# Altium schematic sheet supply.SchDoc: DevelBoard EVA01 Power Supply.
size A3; Author: Daniele Basile <asterix@develer.com>; Organization: Develer s.r.l.; Address1: via Mugellese 1/A; Address2: 50019 Campi Bisenzio; Address3: Firenze; Address4: ITALY; DocumentNumber: 2; Revision: A; SheetNumber: 4; SheetTotal: 6
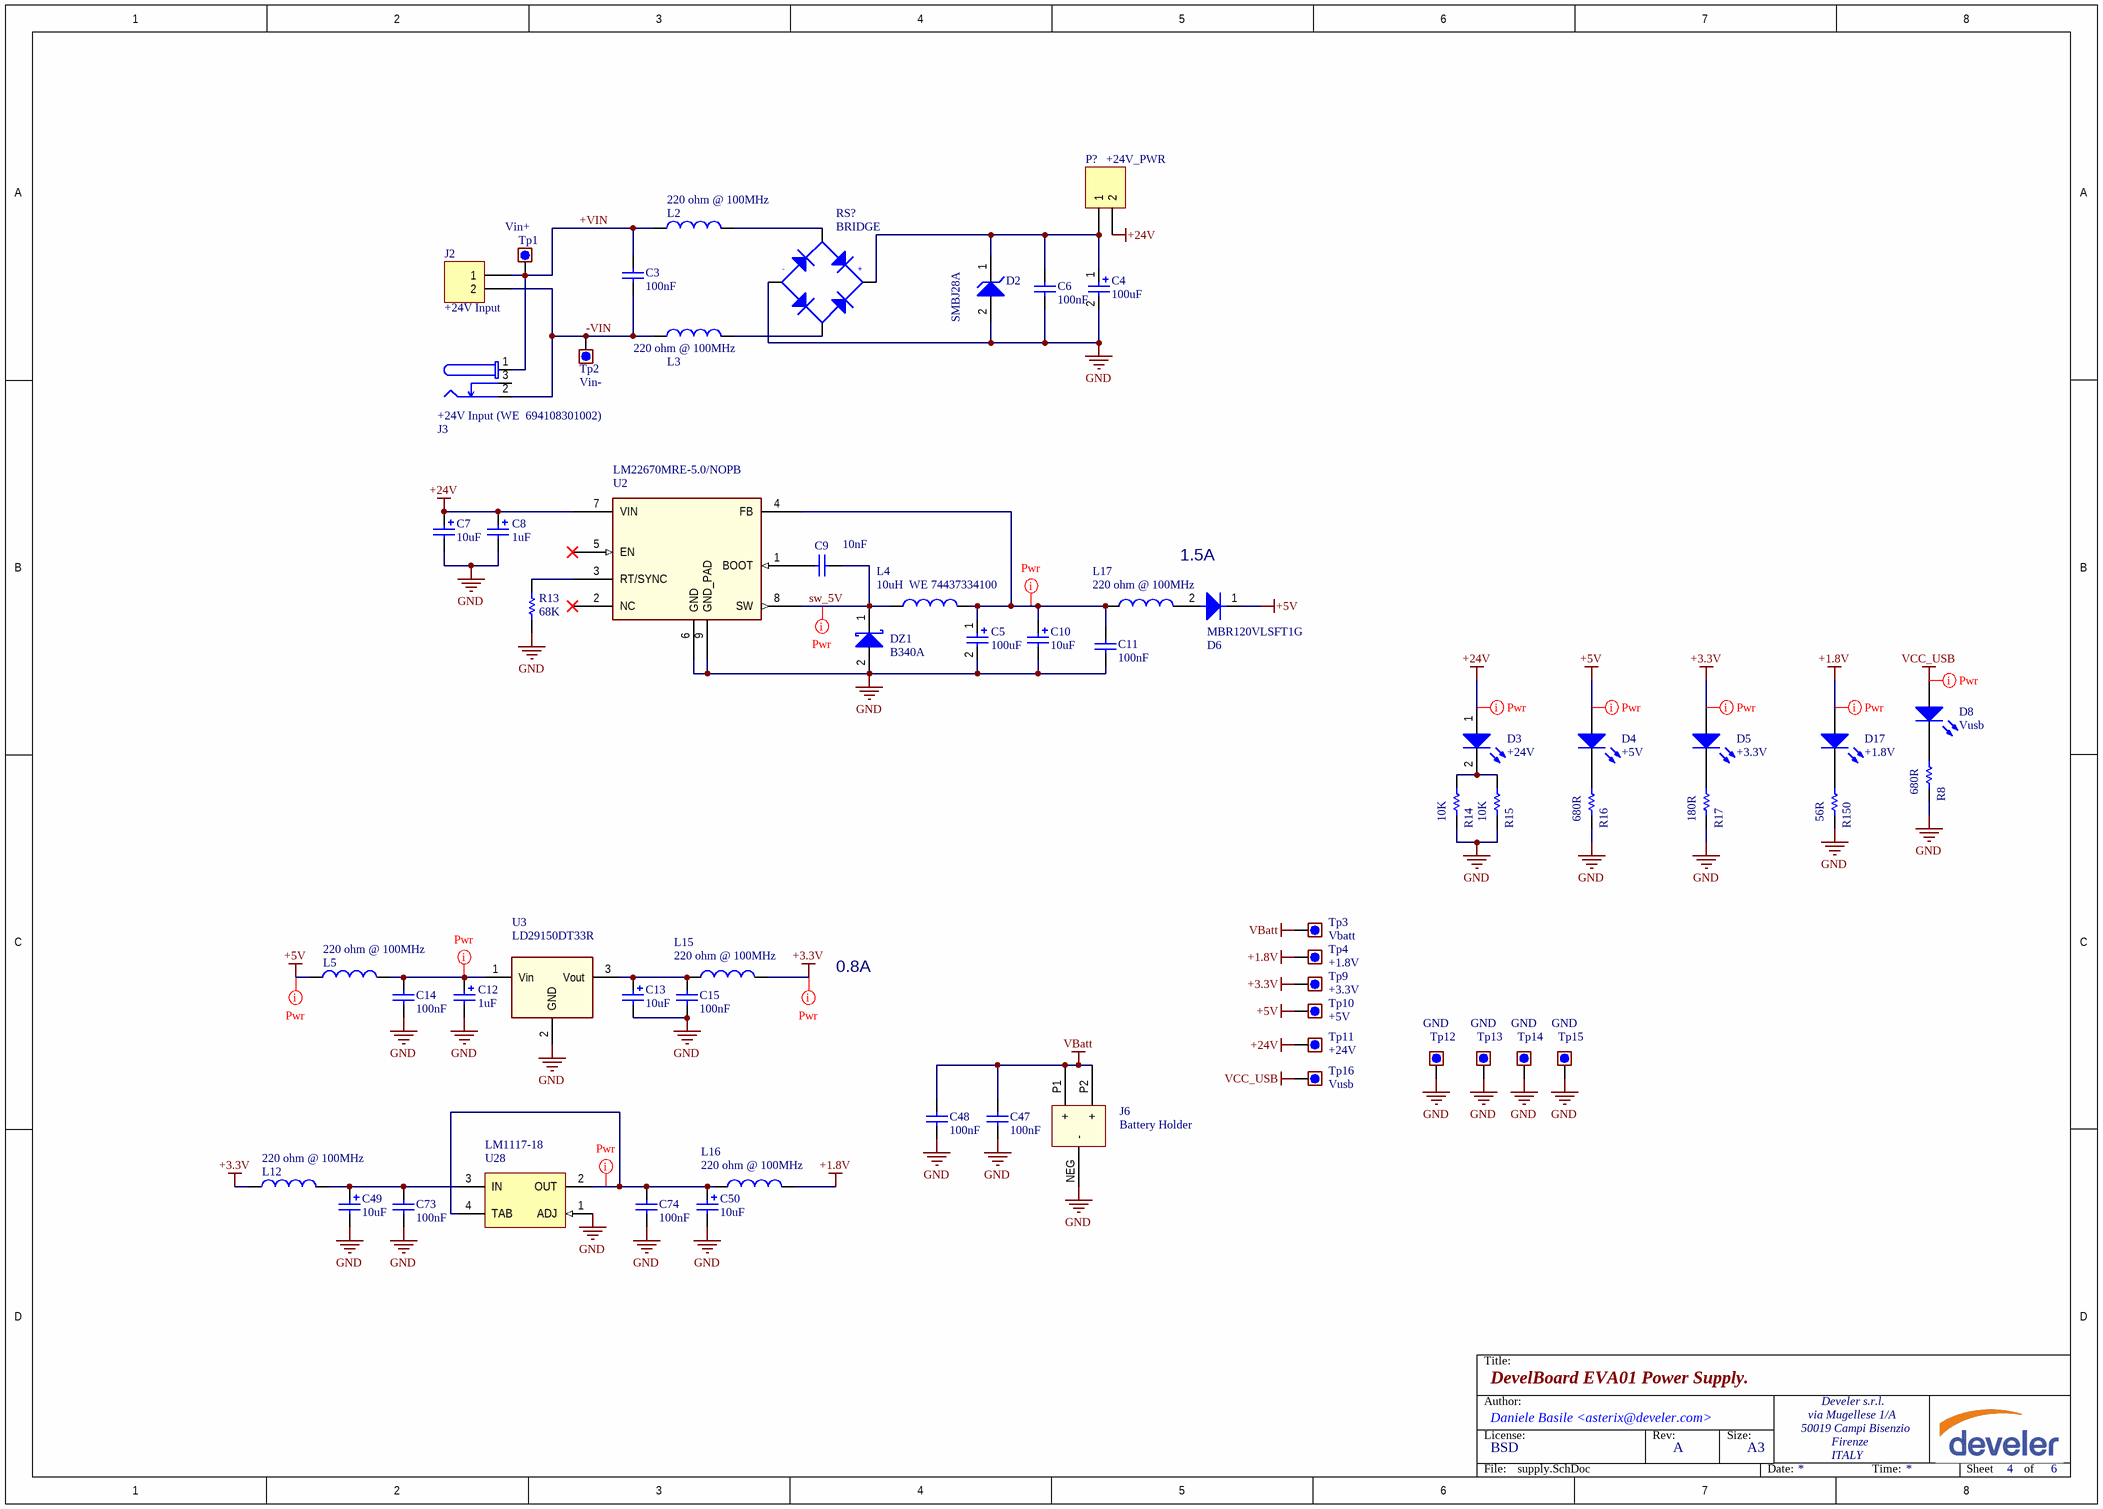
[diagram p0: supply.SchDoc]

## Parts
C3  100nF  [0603_[1608]]
C4  100uF  [CAP_6x6_D8_SMD]
C5  100uF  [[7343]_CAP_TAN]
C6  100nF  [0603_[1608]]
C7  10uF  [1206_[3216]]
C8  1uF  [1206_[3216]]
C9  10nF  [0603_[1608]]
C10  10uF  [1206_[3216]]
C11  100nF  [0603_[1608]]
C12  1uF  [1206_[3216]]
C13  10uF  [1206_[3216]]
C14  100nF  [0603_[1608]]
C15  100nF  [0603_[1608]]
C47  100nF  [0603_[1608]]
C48  100nF  [0603_[1608]]
C49  10uF  [1206_[3216]]
C50  10uF  [1206_[3216]]
C73  100nF  [0603_[1608]]
C74  100nF  [0603_[1608]]
D2  SMBJ28A  [DO214AA_12]
D3  +24V  [0603_[1608]_LED]
D4  +5V  [0603_[1608]_LED]
D5  +3.3V  [0603_[1608]_LED]
D6  MBR120VLSFT1G  [SOD-123]
D8  Vusb  [0603_[1608]_LED]
D17  +1.8V  [0603_[1608]_LED]
DZ1  B340A  [DO214AA_12]
J2  +24V Input  [TBLOCK_1X2_3.5MM_HOR_THD]
J3  +24V Input (WE  694108301002)  [DC_Jack_6.5x2.5mm_right_tht]
J6  Battery Holder  [Battery_holder_20mm_thd]
L2  220 ohm @ 100MHz  [0805_[2012]]
L3  220 ohm @ 100MHz  [0805_[2012]]
L4  10uH  WE 74437334100  [WE-LHMI_5020]
L5  220 ohm @ 100MHz  [0805_[2012]]
L12  220 ohm @ 100MHz  [0805_[2012]]
L15  220 ohm @ 100MHz  [0805_[2012]]
L16  220 ohm @ 100MHz  [0805_[2012]]
L17  220 ohm @ 100MHz  [0805_[2012]]
P?  +24V_PWR  [HDR1X2]
R8  680R  [0603_[1608]]
R13  68K  [0603_[1608]]
R14  10K  [0603_[1608]]
R15  10K  [0603_[1608]]
R16  680R  [0603_[1608]]
R17  180R  [0603_[1608]]
R150  56R  [0603_[1608]]
RS?  BRIDGE
Tp1  Vin+  [TEST_POINT_THD_D1.6MM]  (no BOM)
Tp2  Vin-  [TEST_POINT_THD_D1.6MM]  (no BOM)
Tp3  Vbatt  [TEST_POINT_THD_D1.6MM]  (no BOM)
Tp4  +1.8V  [TEST_POINT_THD_D1.6MM]  (no BOM)
Tp9  +3.3V  [TEST_POINT_THD_D1.6MM]  (no BOM)
Tp10  +5V  [TEST_POINT_THD_D1.6MM]  (no BOM)
Tp11  +24V  [TEST_POINT_THD_D1.6MM]  (no BOM)
Tp12  GND  [TEST_POINT_THD_D1.6MM]  (no BOM)
Tp13  GND  [TEST_POINT_THD_D1.6MM]  (no BOM)
Tp14  GND  [TEST_POINT_THD_D1.6MM]  (no BOM)
Tp15  GND  [TEST_POINT_THD_D1.6MM]  (no BOM)
Tp16  Vusb  [TEST_POINT_THD_D1.6MM]  (no BOM)
U2  LM22670MRE-5.0/NOPB  [SOIC8_PAD]
U3  LD29150DT33R  [TO-252_D2PAK_LARGEPAD]
U28  LM1117-18  [SOT-223]

## Nets
+1.8V: D17.1(A) L16.1 Tp4.1
+3.3V: D5.1(A) L12.1 L15.1 Tp9.1
+5V: D4.1(A) D6.1(K) L5.1 Tp10.1
+24V: C7.1 C8.1 D3.1(A) P?.2 Tp11.1 U2.7(VIN)
GND: C4.2 C5.2 C6.1 C7.2 C8.2 C10.2 C11.1 C12.2 C13.2 C14.1 C15.1 C47.1 C48.1 C49.2 C50.2 C73.1 C74.1 D2.2(A) DZ1.2(A) J6.NEG(-) R8.1 R13.1 R14.1 R15.1 R16.1 R17.1 R150.1 RS?.2 Tp12.1 Tp13.1 Tp14.1 Tp15.1 U2.6(GND) U2.9(GND_PAD) U3.2(GND) U28.1(ADJ)
VBatt: C47.2 C48.2 J6.P1(+) J6.P2(+) Tp3.1
VCC_USB: D8.1(A) Tp16.1
+VIN: C3.2 J2.1 J3.1 L2.1 Tp1.1
-VIN: C3.1 J2.2 J3.2 L3.1 Tp2.1
sw_5V: C9.2 DZ1.1(K) L4.1 U2.8(SW)
NetC4_1: C4.1 C6.2 D2.1(K) P?.1 RS?.4
NetC5_1: C5.1 C10.1 C11.2 L4.2 L17.2 U2.4(FB)
NetC9_1: C9.1 U2.1(BOOT)
NetC12_1: C12.1 C14.2 L5.2 U3.1(Vin)
NetC13_1: C13.1 C15.2 L15.2 U3.3(Vout)
NetC49_1: C49.1 C73.2 L12.2 U28.3(IN)
NetC50_1: C50.1 C74.2 L16.2 U28.2(OUT) U28.4(TAB)
NetD3_2: D3.2(K) R14.2 R15.2
NetD4_2: D4.2(K) R16.2
NetD5_2: D5.2(K) R17.2
NetD6_2: D6.2(A) L17.1
NetD8_2: D8.2(K) R8.2
NetD17_2: D17.2(K) R150.2
NetL2_2: L2.2 RS?.1
NetL3_2: L3.2 RS?.3
NetR13_2: R13.2 U2.3(RT/SYNC)

Not connected (* = marked no-connect by the designer): J3 3; U2 2(NC)* 5(EN)*

## Layout directives
net class Power: +1.8V, +3.3V, +5V, +24V, NetC5_1, NetC12_1, NetC50_1, sw_5V, VCC_USB

## Notes on the sheet
- 1.5A
- 0.8A
- Title:
- Author:
- License:
- BSD
- Rev:
- Size:
- A3
- File:
- Date:
- Time:
- Sheet
- of
- (in symbol PONTE) -; +

## Library data of the parts
C3 C6 C9 C11 C14 C15 C47 C48 C73 C74 = Cap: Ceramic X7R 50V; Value: 100pF; Published: 8-Jun-2000; LatestRevisionDate: 17-Jul-2002; LatestRevisionNote: Re-released for DXP Platform.; PackageReference: RAD-0.3; Publisher: Altium Limited; PackageDescription: Radial Cap, Thru-Hole; 2 Leads; 0.3 in Pin Spacing
C4 = Cap Pol1: EEEFK1H101P SMT 6x6 35V; Value: 10uF; Published: 8-Jun-2000; Revision: July-2002: Re-released for DXP Platform.; Publisher: Altium Limited
C5 = Cap Pol1: Tantalum 10V (T495D107K010ATE100); Value: 10uF; Published: 8-Jun-2000; Revision: July-2002: Re-released for DXP Platform.; Publisher: Altium Limited
C7 C10 C13 C49 C50 = Cap Pol1: Ceramic X7R 50V; Published: 8-Jun-2000; Revision: July-2002: Re-released for DXP Platform.; Publisher: Altium Limited; Value: 10uF
C8 C12 = Cap Pol1: Ceramic X7R 50V; Value: 10uF; Published: 8-Jun-2000; Revision: July-2002: Re-released for DXP Platform.; Publisher: Altium Limited
D2 = D Zener: TRANSIL (SM6T12A); Published: 8-Jun-2000; LatestRevisionDate: 17-Jul-2002; LatestRevisionNote: Re-released for DXP Platform.; PackageReference: DIODE-0.7; Publisher: Altium Limited; PackageDescription: Diode, Thru-Hole; 2 Leads; 0.7 in Pin Spacing
D3-D5 D8 D17 = LED0: LED Green; Published: 8-Jun-2000; LatestRevisionDate: 08-Jul-2005; LatestRevisionNote: Mech Layer 1 removed.; PackageReference: LED-0; Publisher: Altium Limited; PackageDescription: LED; 2 Leads
D6 = Diode: Diode Schottky  low Vf, If 1A (PMEG3010ER; MBRX120LF)
DZ1 = D Schottky: Diode Schottky (STPS2L40U); Published: 8-Jun-2000; LatestRevisionDate: 17-Jul-2002; LatestRevisionNote: Re-released for DXP Platform.; PackageReference: SMB; Publisher: Altium Limited; PackageDescription: DO-214-AA/SMB; 2 C-Bend Leads; Body 5.3 x 3.6 mm, inc. leads (LxW); Code_JEDEC: DO-214-AA
J2 = Header 2: Terminal block Header 3.5mm Horizontal (WE 691322110002); LatestRevisionDate: 17-Jul-2002; LatestRevisionNote: Re-released for DXP Platform.; Publisher: Altium Limited
J3 = WE-DC Power Jack 694108301002: WR-DC_DC Power Jack_Right Angled_THT; Manufacturer: W¨¹rth Elektronik eiSos GmbH; ComponentLink1 Description: Manufacturer; ComponentLink2 Description: Datasheet; NoPins: 3; ComponentLink1URL: http://www.we-online.de; ComponentLink2URL: http://katalog.we-online.de/em/datasheet/6941xx301002.pdf; Created by: Karrer Zheng; Created Date: 10/17/2014; partNo: 694108301002
J6 = Battery_holder_3002: WE 79523211; KEYSTONE 3009
L2 L3 L5 L12 = Inductor: WE 742792022; Code_IEC: 1005; Value: 10mH; Published: 8-Jun-2000; LatestRevisionDate: 29-May-2009; LatestRevisionNote: IPC-7351 Footprint Added.; PackageReference: 0402-A; Publisher: Altium Limited; PackageDescription: Chip Inductor; Code_JEITA: 0402
L4 = Inductor: SMD Shielded Tiny Power Inductor; Code_IEC: 1005; Value: 10mH; Published: 8-Jun-2000; LatestRevisionDate: 29-May-2009; LatestRevisionNote: IPC-7351 Footprint Added.; PackageReference: 0402-A; Publisher: Altium Limited; PackageDescription: Chip Inductor; Code_JEITA: 0402
L15-L17 = Inductor: WE 742792022
P? = Header 2: Header, 2-Pin; LatestRevisionDate: 17-Jul-2002; LatestRevisionNote: Re-released for DXP Platform.; Publisher: Altium Limited
R8 R13-R17 R150 = Res1: Resistor; Revision: July-2002: Re-released for DXP Platform.
RS? = PONTE
Tp1-Tp4 Tp9-Tp16 = Test_point
U2 = LM22670MR-ADJ
U3 = LD29150DT33R: Very Low Drop Linear regulator 3.3V (BA33BC0FP-E2; MIC2940A-3.3WU)
U28 = LM317AEMP: LDO, ADJ (ZLDO1117;LM1117IMP-ADJ/NOPB;LD1117S); Manufacturer: National Semiconductor; PackageTopMarking: XYTT*N07A; PowerWise: N; CompType: LDO IC; Published: 4-Dec-2008; DatasheetVersion: Apr-2007; PackageVersion: revB, Apr-2003; PackageReference: MP04A; Publisher: Altium Limited; PackageDescription: Molded SOT-223, 6.50 x 3.56 x 1.6mm Body, 4 Lead, 2.3mm Pitch; Supplier 1: Farnell; Supplier Part Number 1: 9779272RL; Supplier 2: Farnell; Supplier Part Number 2: 9779272; PartNumber: LM317AEMP; RoHS: N; PinCount: 4; Code_JEDEC: TO-261-AA; Code_IPC: SOT223-4; ComponentLink1Description: LM317 Datasheet; ComponentLink1URL: http://www.national.com/ds/LM/LM317.pdf; ComponentLink2Description: LM317 Web Page; ComponentLink2URL: http://www.national.com/pf/LM/LM317.html; ComponentLink3Description: MP04A Package Page; ComponentLink3URL: http://www.national.com/packaging/folders/mp04a.html